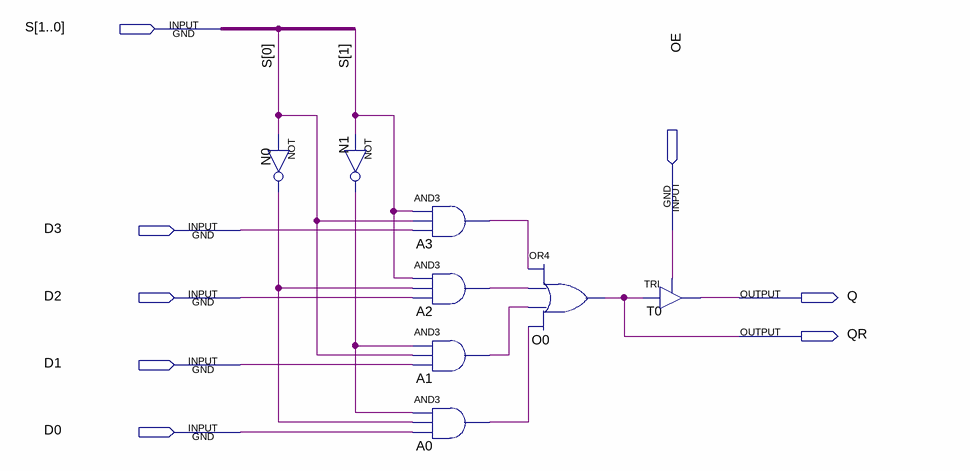
[diagram p0: schematic sheet]
// Quartus schematic mux4to1tri.bdf as structural Verilog: 8 symbols, 8 pins
module mux4to1tri (
  input  [1:0] S,
  input  D3,
  input  OE,
  input  D2,
  input  D1,
  input  D0,
  output Q,
  output QR
);

  wire A0_out, A1_out, A2_out, A3_out, N0_out, N1_out;

  not N0 (N0_out, S[0]);
  not N1 (N1_out, S[1]);
  and A3 (A3_out, S[1], S[0], D3);
  and A2 (A2_out, S[1], N0_out, D2);
  and A1 (A1_out, N1_out, S[0], D1);
  and A0 (A0_out, N1_out, N0_out, D0);
  or O0 (QR, A3_out, A2_out, A1_out, A0_out);
  TRI T0 (.IN(QR), .OE(OE), .OUT(Q));
endmodule
